# EAGLE design Reach_B0 (EAGLE 7.7.0)
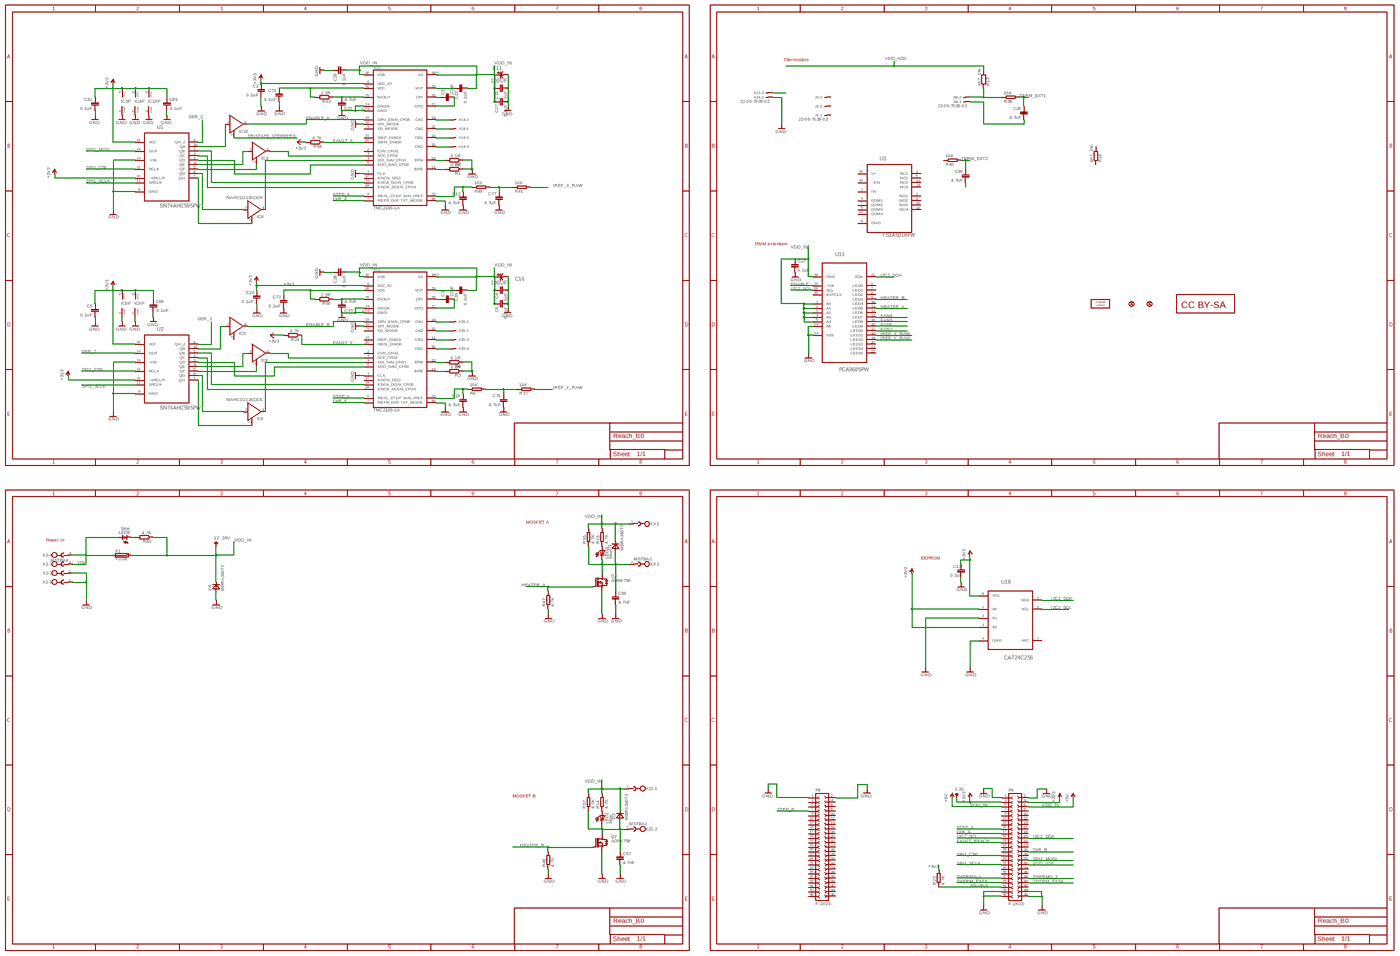
[diagram p0: schematic, sheet 1, overview]
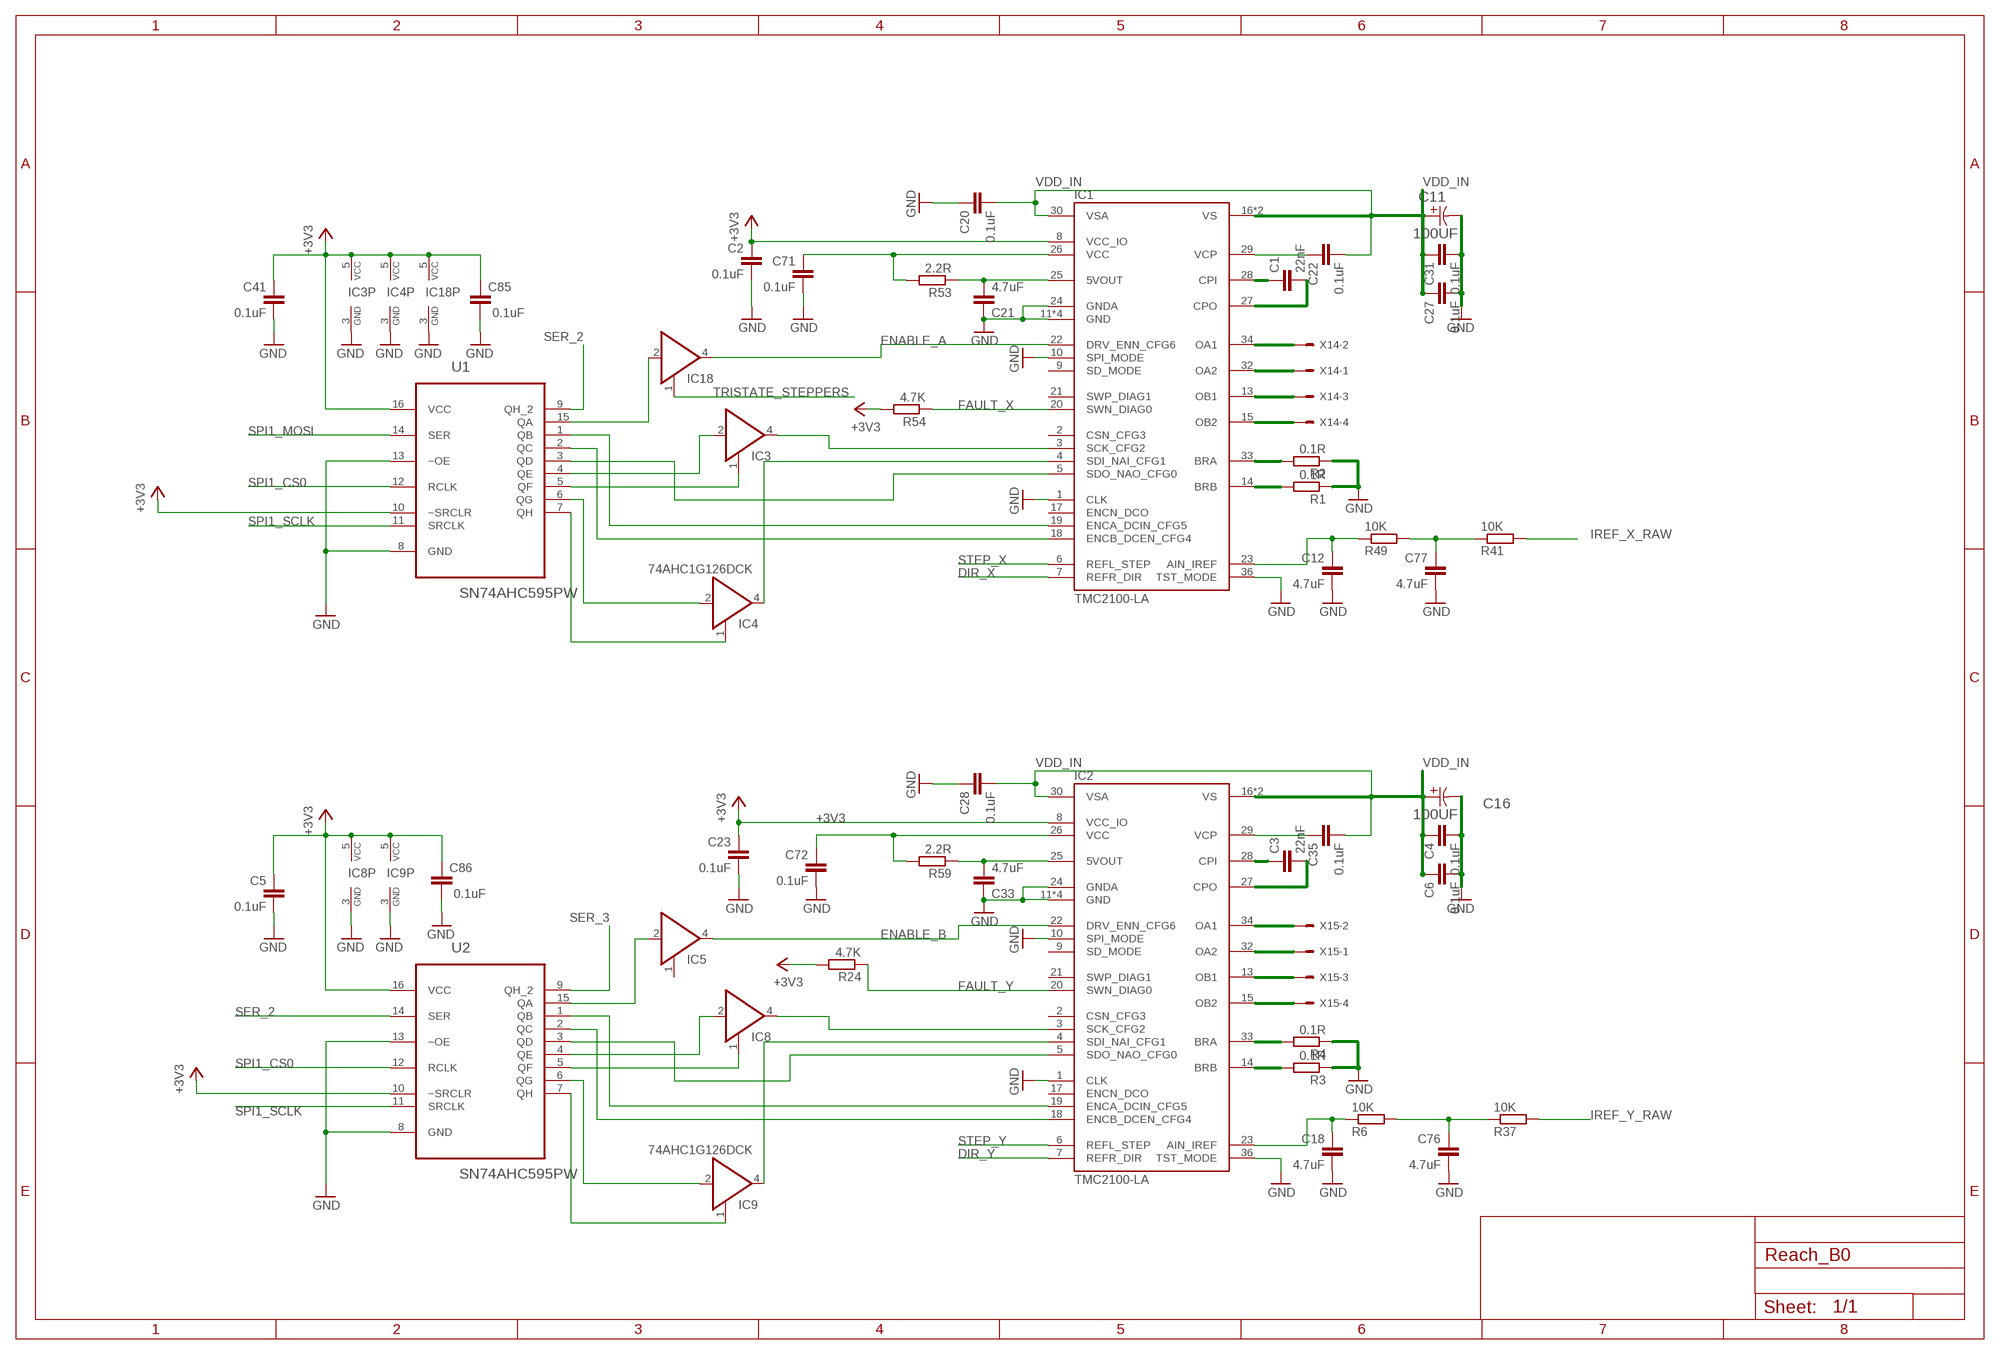
[diagram p1: schematic, sheet 1, part 1 of 4]
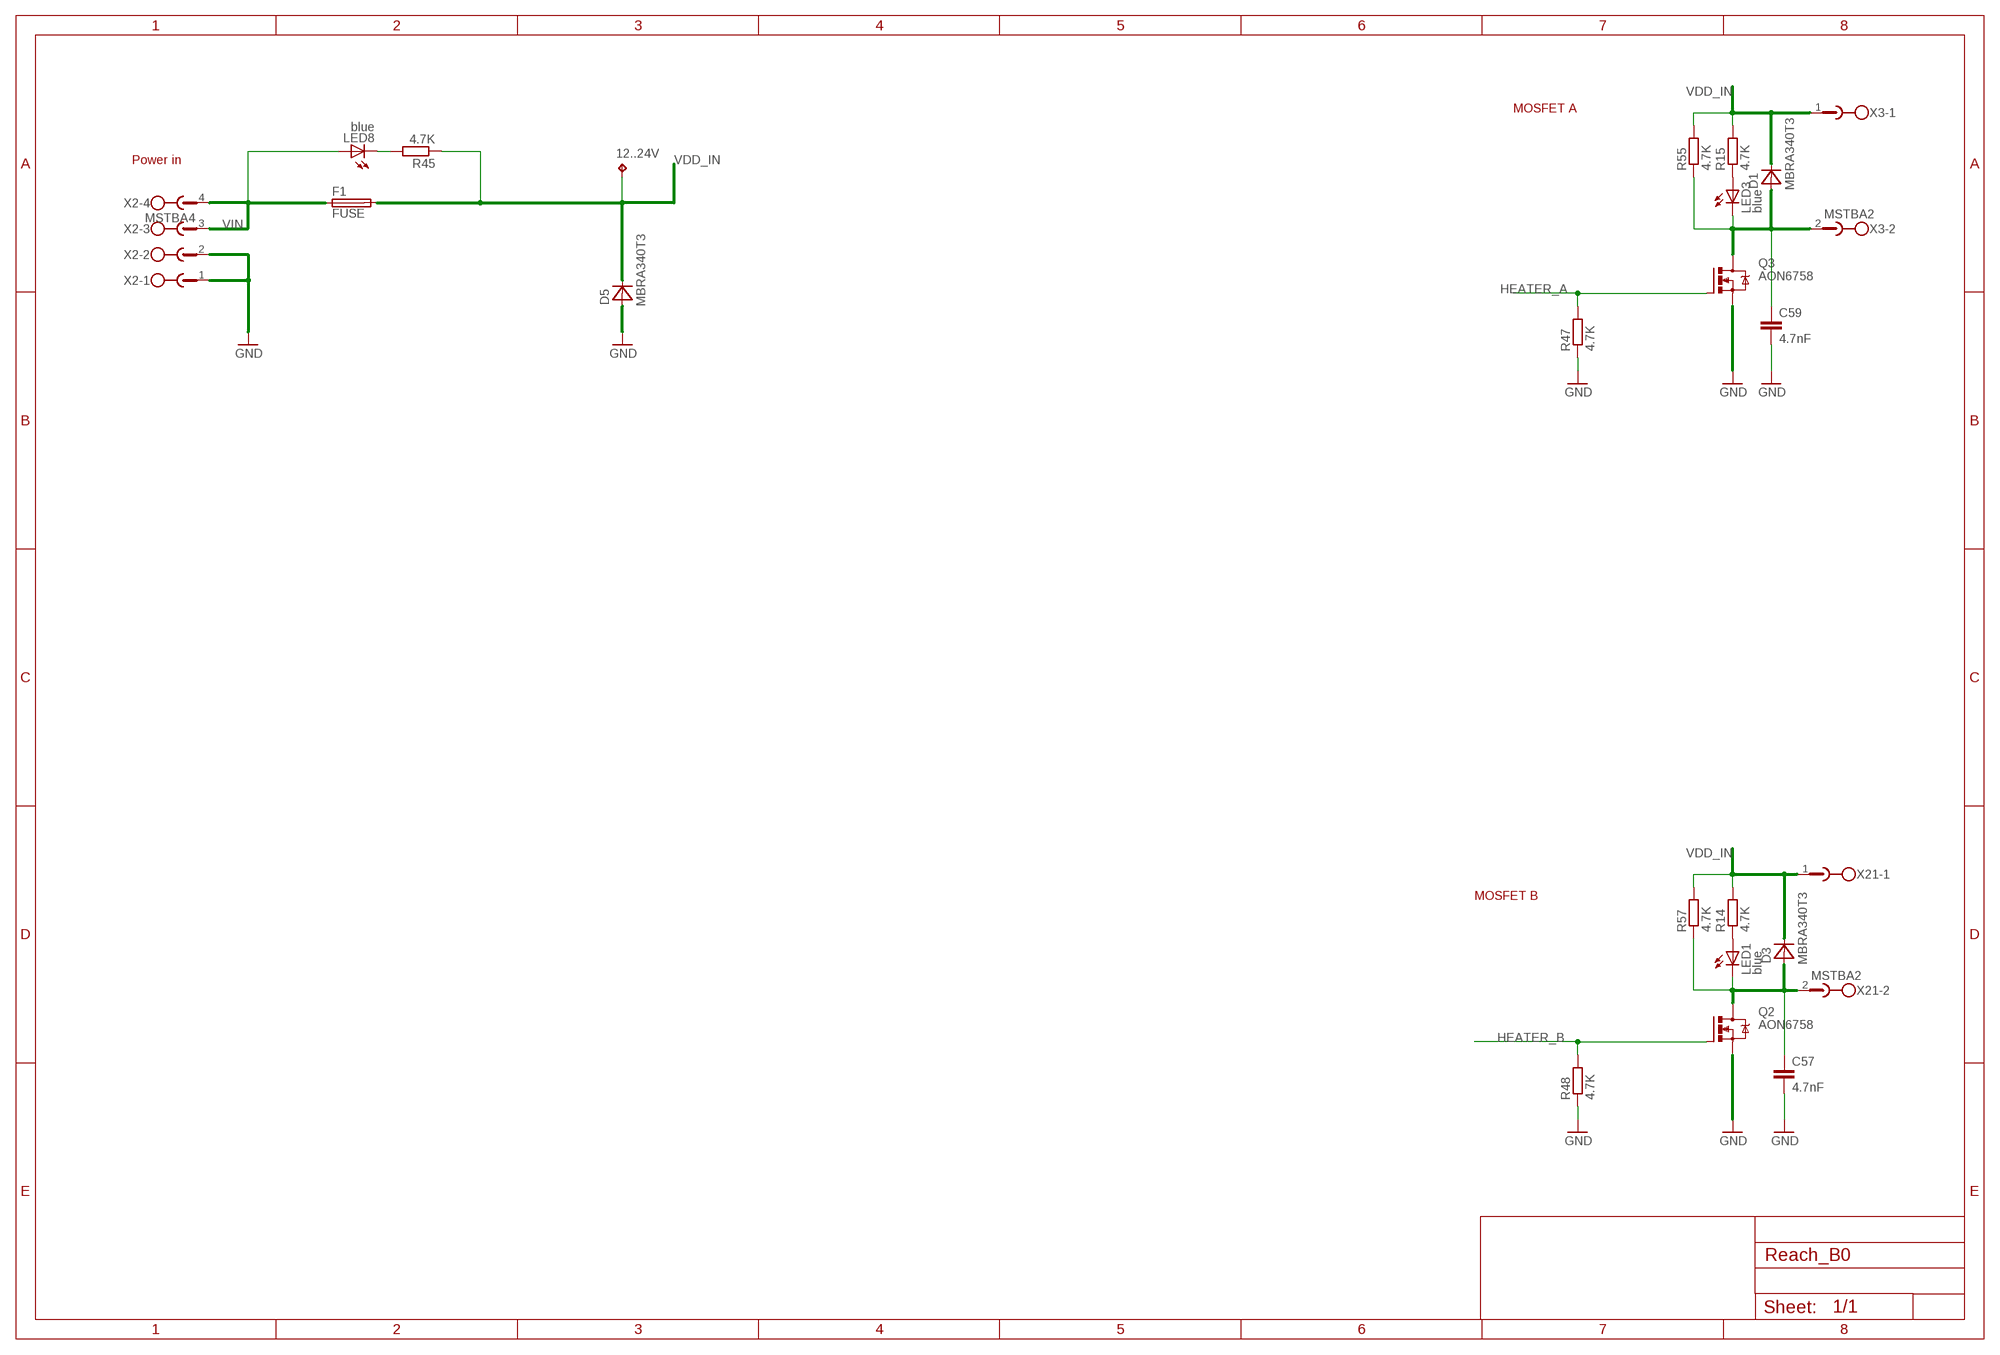
[diagram p2: schematic, sheet 1, part 2 of 4]
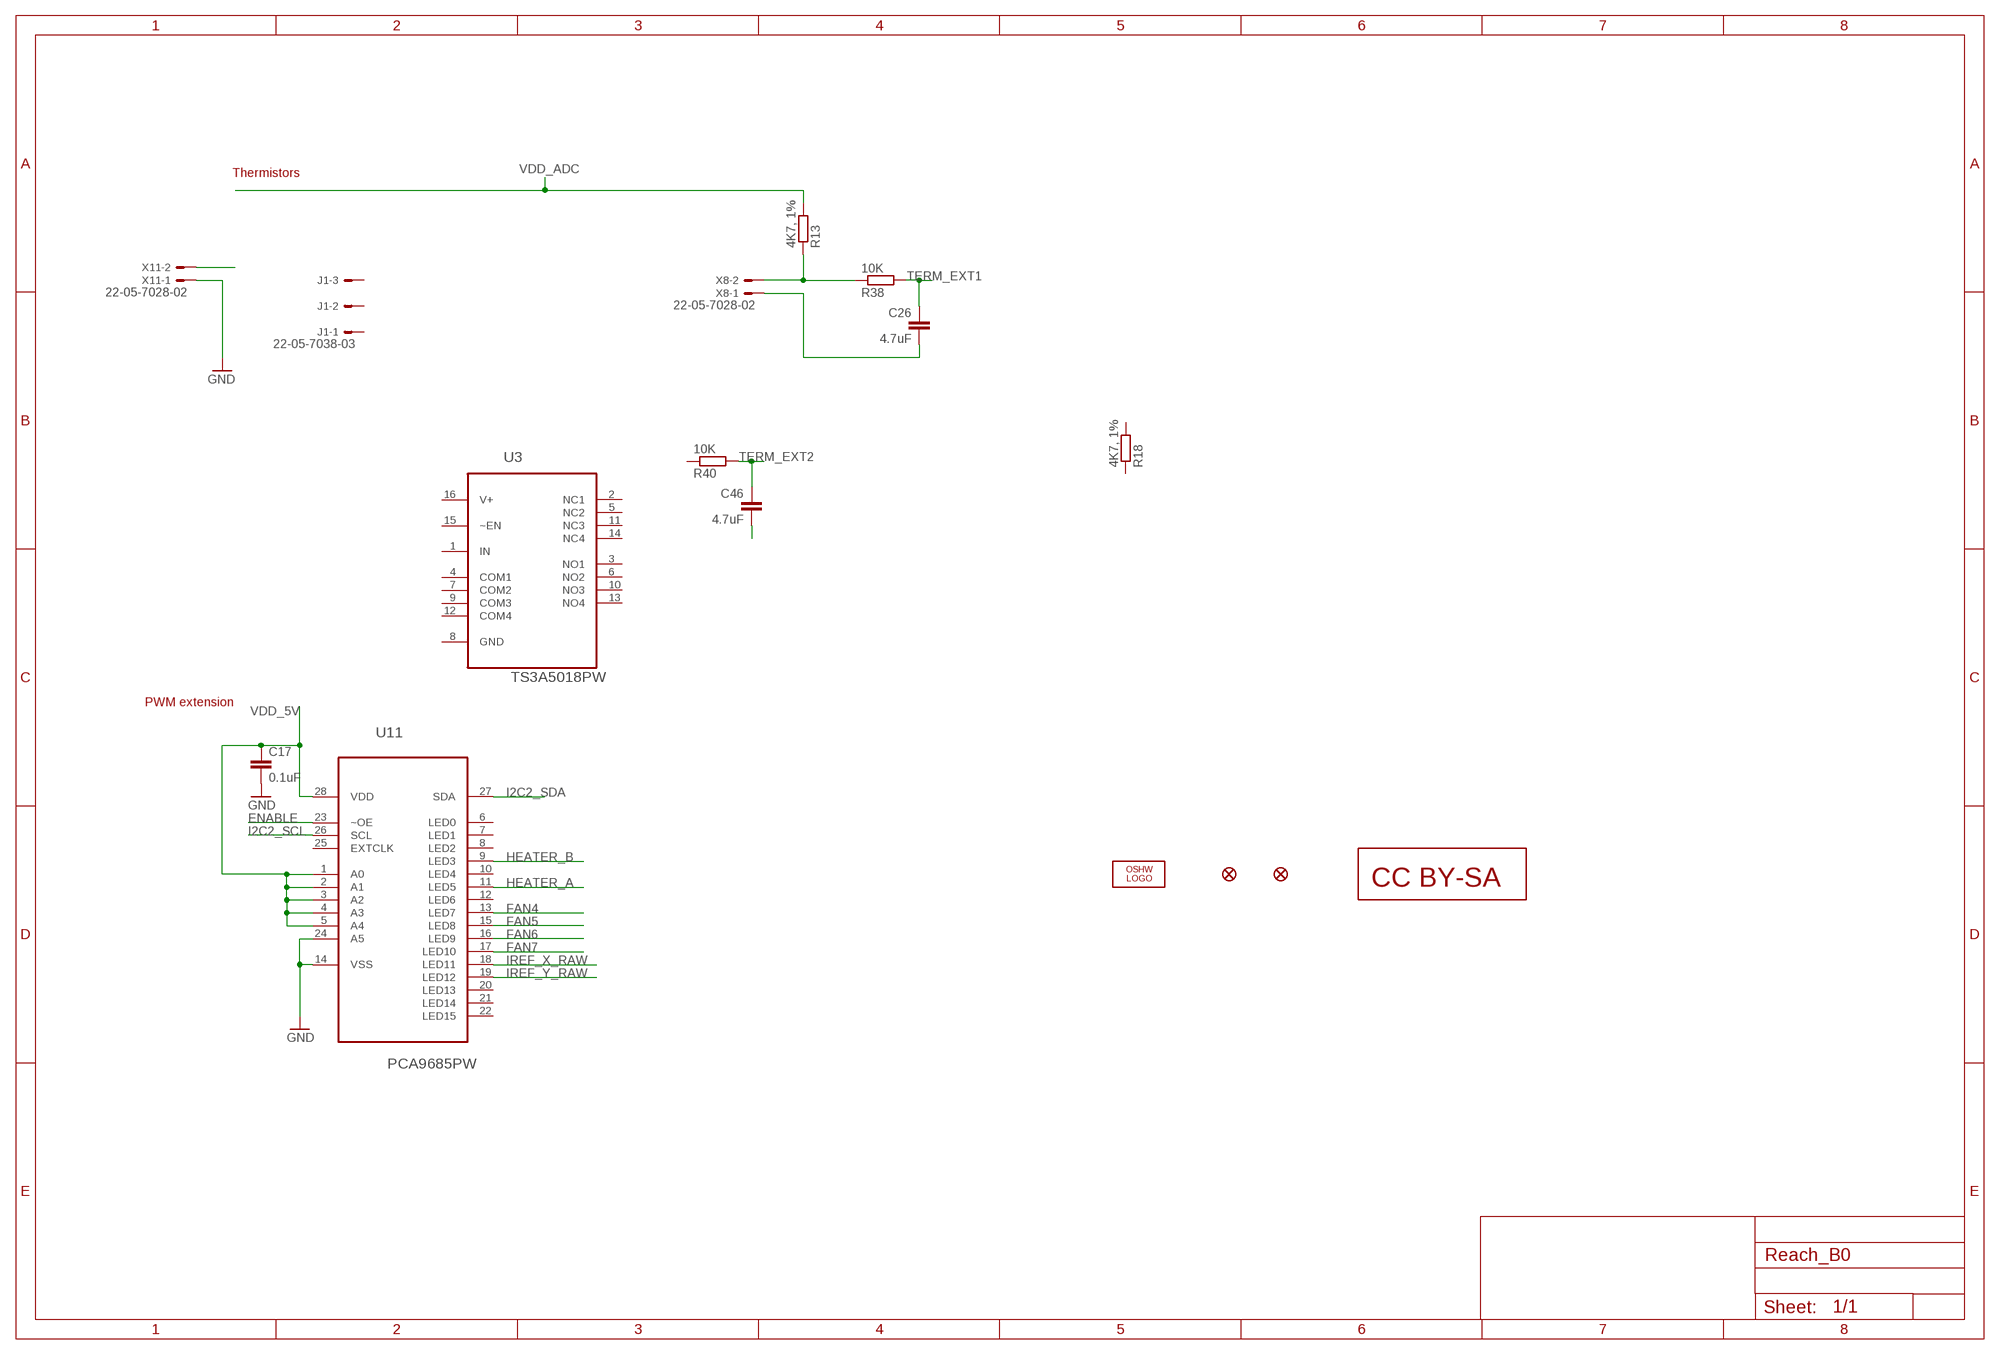
[diagram p3: schematic, sheet 1, part 3 of 4]
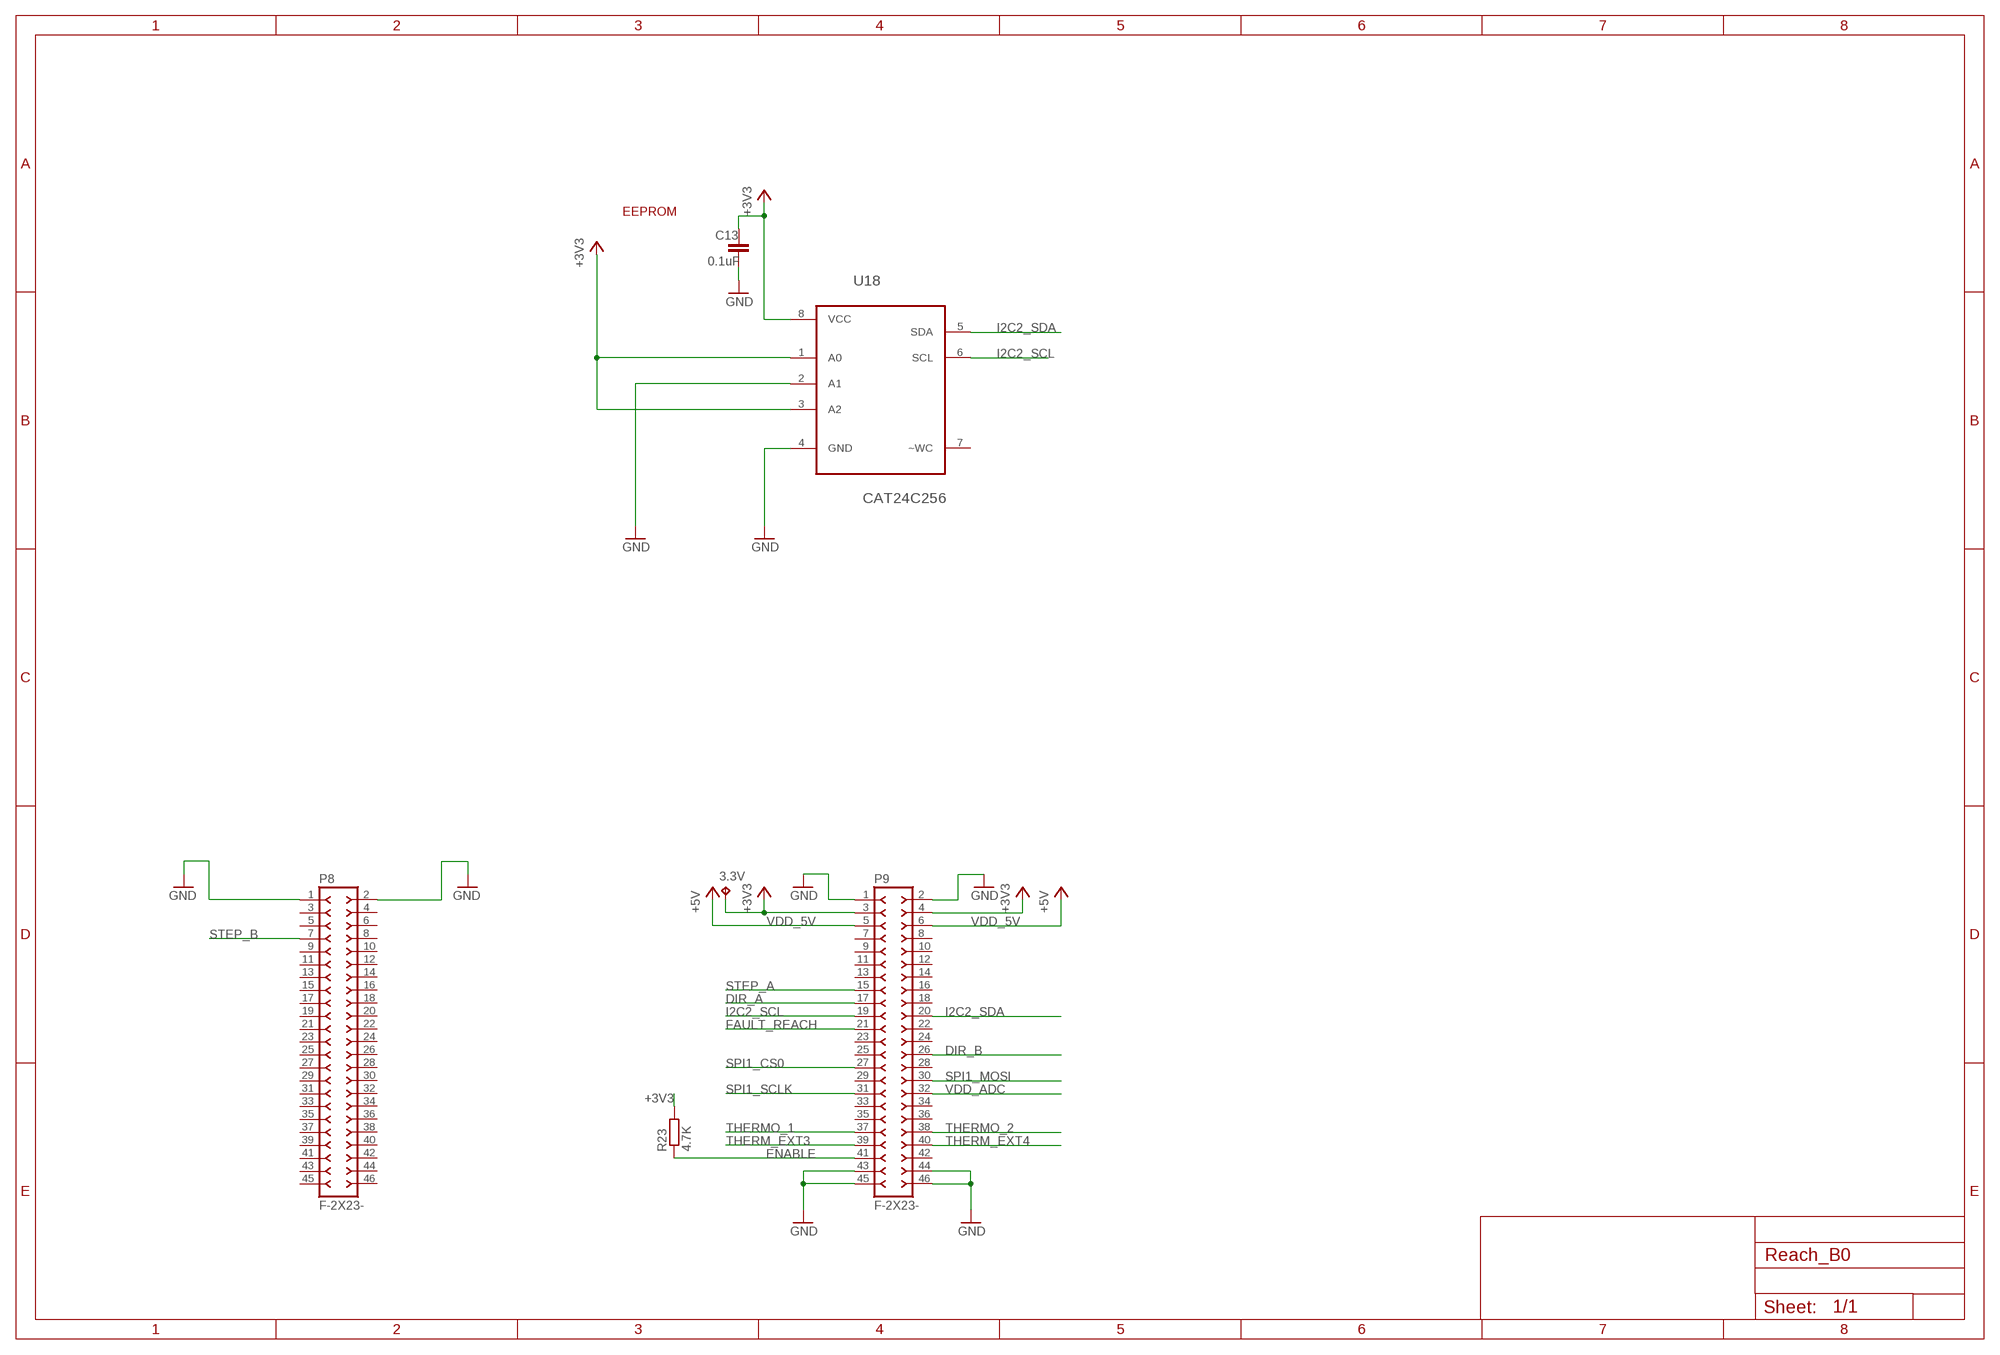
[diagram p4: schematic, sheet 1, part 4 of 4]

## Parts
3.3V  TPB1,27  [B1,27]
12..24V  TPB1,27  [B1,27]
C1  22nF  C-EUC0402  [C0402]
C2  0.1uF  C-EUC0402  [C0402]
C3  22nF  C-EUC0402  [C0402]
C4  0.1uF  C-EUC0402  [C0402]
C5  0.1uF  C-EUC0402  [C0402]
C6  0.1uF  C-EUC0402  [C0402]
C11  100UF  EEE-FK1V101XP-CASE-D8  [CAPAE660X800N]
C12  4.7uF  C-EUC0402  [C0402]
C13  0.1uF  C-EUC0402  [C0402]
C16  100UF  EEE-FK1V101XP-CASE-D8  [CAPAE660X800N]
C17  0.1uF  C-EUC0402  [C0402]
C18  4.7uF  C-EUC0402  [C0402]
C20  0.1uF  C-EUC0402  [C0402]
C21  4.7uF  C-EUC0402  [C0402]
C22  0.1uF  C-EUC0402  [C0402]
C23  0.1uF  C-EUC0402  [C0402]
C26  4.7uF  C-EUC0402  [C0402]
C27  0.1uF  C-EUC0402  [C0402]
C28  0.1uF  C-EUC0402  [C0402]
C31  0.1uF  C-EUC0402  [C0402]
C33  4.7uF  C-EUC0402  [C0402]
C35  0.1uF  C-EUC0402  [C0402]
C41  0.1uF  C-EUC0402  [C0402]
C46  4.7uF  C-EUC0402  [C0402]
C57  4.7nF  C-EUC0402  [C0402]
C59  4.7nF  C-EUC0402  [C0402]
C71  0.1uF  C-EUC0402  [C0402]
C72  0.1uF  C-EUC0402  [C0402]
C76  4.7uF  C-EUC0402  [C0402]
C77  4.7uF  C-EUC0402  [C0402]
C85  0.1uF  C-EUC0402  [C0402]
C86  0.1uF  C-EUC0402  [C0402]
D1  MBRA340T3  [SMA]
D3  MBRA340T3  [SMA]
D5  MBRA340T3  [SMA]
F1  FUSE  [3557]
IC1  TMC2100-LA  [QFN36-PAD]
IC2  TMC2100-LA  [QFN36-PAD]
IC3  74AHC1G126DCK  [SC70-5]
IC4  74AHC1G126DCK  [SC70-5]
IC5  74AHC1G126DCK  [SC70-5]
IC8  74AHC1G126DCK  [SC70-5]
IC9  74AHC1G126DCK  [SC70-5]
IC18  74AHC1G126DCK  [SC70-5]
J1  22-05-7038-03  [7395-03]
JP1  FIDUCIAL1X2.5  [FIDUCIAL-1X2.5]
JP2  FIDUCIAL1X2.5  [FIDUCIAL-1X2.5]
LED1  blue  LEDCHIP-LED0603  [CHIP-LED0603]
LED3  blue  LEDCHIP-LED0603  [CHIP-LED0603]
LED8  blue  LEDCHIP-LED0603  [CHIP-LED0603]
LOGO1  OSHW_LOGO_FILLX0200-NT  [OSHW_FILLX200_NOTEXT]
P8  F-2X23-  [DIL-100-2X23]
P9  F-2X23-  [DIL-100-2X23]
Q2  AON6758  [8-DFN-EP-(5X6)]
Q3  AON6758  [8-DFN-EP-(5X6)]
R1  0.1R  R-EU_R0805  [R0805]
R2  0.1R  R-EU_R0805  [R0805]
R3  0.1R  R-EU_R0805  [R0805]
R4  0.1R  R-EU_R0805  [R0805]
R6  10K  R-EU_R0402  [R0402]
R13  4K7, 1%  R-EU_R0402  [R0402]
R14  4.7K  R-EU_R0402  [R0402]
R15  4.7K  R-EU_R0402  [R0402]
R18  4K7, 1%  R-EU_R0402  [R0402]
R23  4.7K  R-EU_R0402  [R0402]
R24  4.7K  R-EU_R0402  [R0402]
R37  10K  R-EU_R0402  [R0402]
R38  10K  R-EU_R0402  [R0402]
R40  10K  R-EU_R0402  [R0402]
R41  10K  R-EU_R0402  [R0402]
R45  4.7K  R-EU_R0402  [R0402]
R47  4.7K  R-EU_R0402  [R0402]
R48  4.7K  R-EU_R0402  [R0402]
R49  10K  R-EU_R0402  [R0402]
R53  2.2R  R-EU_R0402  [R0402]
R54  4.7K  R-EU_R0402  [R0402]
R55  4.7K  R-EU_R0402  [R0402]
R57  4.7K  R-EU_R0402  [R0402]
R59  2.2R  R-EU_R0402  [R0402]
U1  SN74AHC595PW  [SOP65P640X120-16N]
U2  SN74AHC595PW  [SOP65P640X120-16N]
U3  TS3A5018PW  [SOP65P640X120-16N]
U11  PCA9685PW  [SOP65P640X110-28N]
U18  CAT24C256  [SOIC127P600X175-8N]
U$4  CC-BY-SA  [CC-BY-SA]
X2  MSTBA4  [MSTBA4]
X3  MSTBA2  [MSTBA2]
X8  22-05-7028-02  [7395-02]
X11  22-05-7028-02  [7395-02]
X14  22-05-7048-04  [7395-04]
X15  22-05-7048-04  [7395-04]
X21  MSTBA2  [MSTBA2]

## Nets
+3V3: 3.3V.TP C2.1 C5.1 C13.1 C23.1 C41.1 C85.1 C86.1 IC1.8(VCC_IO) IC2.8(VCC_IO) IC3.5(VCC) IC4.5(VCC) IC8.5(VCC) IC9.5(VCC) IC18.5(VCC) P9.3 P9.4 R23.2 R24.2 R54.2 U1.10(~SRCLR) U1.16(VCC) U2.10(~SRCLR) U2.16(VCC) U18.1(A0) U18.3(A2) U18.8(VCC)
DIR_A: P9.17
DIR_B: P9.26
DIR_X: IC1.7(REFR_DIR)
DIR_Y: IC2.7(REFR_DIR)
ENABLE: P9.41 R23.1 U11.23(~OE)
ENABLE_A: IC1.22(DRV_ENN_CFG6) IC18.4(O)
ENABLE_B: IC2.22(DRV_ENN_CFG6) IC5.4(O)
FAN4: U11.13(LED7)
FAN5: U11.15(LED8)
FAN6: U11.16(LED9)
FAN7: U11.17(LED10)
FAULT_REACH: P9.21
FAULT_X: IC1.20(SWN_DIAG0) R54.1
FAULT_Y: IC2.20(SWN_DIAG0) R24.1
GND: C2.2 C4.2 C5.2 C6.2 C11.2 C12.2 C13.2 C16.2 C17.2 C18.2 C20.1 C21.1 C23.2 C27.2 C28.1 C31.2 C33.1 C41.2 C57.2 C59.2 C71.2 C72.2 C76.2 C77.2 C85.2 C86.2 D5.A IC1.1(CLK) IC1.10(SPI_MODE) IC1.11(GND) IC1.12(GND) IC1.24(GNDA) IC1.35(GND) IC1.36(TST_MODE) IC1.TP(GND) IC2.1(CLK) IC2.10(SPI_MODE) IC2.11(GND) IC2.12(GND) IC2.24(GNDA) IC2.35(GND) IC2.36(TST_MODE) IC2.TP(GND) IC3.3(GND) IC4.3(GND) IC8.3(GND) IC9.3(GND) IC18.3(GND) P8.1 P8.2 P9.1 P9.2 P9.43 P9.44 P9.45 P9.46 Q2.1(S) Q2.2(S) Q2.3(S) Q3.1(S) Q3.2(S) Q3.3(S) R1.1 R2.1 R3.1 R4.1 R47.1 R48.1 U1.8(GND) U1.13(~OE) U2.8(GND) U2.13(~OE) U11.14(VSS) U11.24(A5) U18.2(A1) U18.4(GND) X2.1 X2.2 X11.1
HEATER_A: Q3.4(G) R47.2 U11.11(LED5)
HEATER_B: Q2.4(G) R48.2 U11.9(LED3)
I2C2_SCL: P9.19 U11.26(SCL) U18.6(SCL)
I2C2_SDA: P9.20 U11.27(SDA) U18.5(SDA)
IREF_X: C77.1 R41.1 R49.2
IREF_X_RAW: R41.2 U11.18(LED11)
IREF_Y: C76.1 R6.2 R37.1
IREF_Y_RAW: R37.2 U11.19(LED12)
N$1: IC5.2(I) U2.15(QA)
N$2: IC2.13(OB1) X15.3
N$3: C3.2 IC2.27(CPO)
N$4: IC4.1(OE) U1.7(QH)
N$5: IC4.2(I) U1.6(QG)
N$6: IC1.18(ENCB_DCEN_CFG4) U1.2(QC)
N$8: LED8.C R45.2
N$9: C46.2
N$11: C26.2 X8.1
N$16: C1.1 IC1.28(CPI)
N$17: C1.2 IC1.27(CPO)
N$18: IC1.14(BRB) R1.2
N$19: IC1.33(BRA) R2.2
N$20: C12.1 IC1.23(AIN_IREF) R49.1
N$22: IC2.32(OA2) X15.1
N$31: C21.2 IC1.25(5VOUT) R53.1
N$33: C22.1 IC1.29(VCP)
N$34: IC3.2(I) U1.4(QE)
N$35: IC2.14(BRB) R3.2
N$36: IC2.33(BRA) R4.2
N$38: C18.1 IC2.23(AIN_IREF) R6.1
N$40: IC3.1(OE) U1.5(QF)
N$41: C3.1 IC2.28(CPI)
N$42: IC2.3(SCK_CFG2) IC8.4(O)
N$43: IC1.19(ENCA_DCIN_CFG5) U1.1(QB)
N$44: IC1.5(SDO_NAO_CFG0) U1.3(QD)
N$45: IC2.15(OB2) X15.4
N$46: IC2.34(OA1) X15.2
N$47: C33.2 IC2.25(5VOUT) R59.1
N$48: C35.1 IC2.29(VCP)
N$49: IC2.4(SDI_NAI_CFG1) IC9.4(O)
N$53: IC2.5(SDO_NAO_CFG0) U2.3(QD)
N$56: IC2.18(ENCB_DCEN_CFG4) U2.2(QC)
N$64: C57.1 D3.A LED1.C Q2.5(D) Q2.6(D) Q2.7(D) Q2.8(D) Q2.TH(D) R57.1 X21.2
N$65: IC2.19(ENCA_DCIN_CFG5) U2.1(QB)
N$66: IC9.1(OE) U2.7(QH)
N$67: IC9.2(I) U2.6(QG)
N$68: IC8.1(OE) U2.5(QF)
N$69: IC8.2(I) U2.4(QE)
N$108: C71.1 IC1.26(VCC) R53.2
N$110: C72.1 IC2.26(VCC) R59.2
N$120: IC18.2(I) U1.15(QA)
N$127: LED3.A R15.1
N$129: LED1.A R14.1
N$234: C59.1 D1.A LED3.C Q3.5(D) Q3.6(D) Q3.7(D) Q3.8(D) Q3.TH(D) R55.1 X3.2
N$237: R13.1 R38.1 X8.2
N$240: X11.2
SER_2: U1.9(QH_2) U2.14(SER)
SER_3: U2.9(QH_2)
SPI1_CS0: P9.27 U1.12(RCLK) U2.12(RCLK)
SPI1_MOSI: P9.30 U1.14(SER)
SPI1_SCLK: P9.31 U1.11(SRCLK) U2.11(SRCLK)
STEP_A: P9.15
STEP_B: P8.7
STEP_X: IC1.6(REFL_STEP)
STEP_Y: IC2.6(REFL_STEP)
TERM_EXT1: C26.1 R38.2
TERM_EXT2: C46.1 R40.2
THERM_EXT3: P9.39
THERM_EXT4: P9.40
THERMO_1: P9.37
THERMO_2: P9.38
TRISTATE_STEPPERS: IC18.1(OE)
VDD_5V: C17.1 P9.5 P9.6 U11.1(A0) U11.2(A1) U11.3(A2) U11.4(A3) U11.5(A4) U11.28(VDD) ; supply symbol labelled +5V
VDD_ADC: P9.32 R13.2
VDD_IN: 12..24V.TP C4.1 C6.1 C11.1 C16.1 C20.2 C22.2 C27.1 C28.2 C31.1 C35.2 D1.C D3.C D5.C F1.P$3 F1.P$4 IC1.16(VS) IC1.30(VSA) IC1.31(VS) IC2.16(VS) IC2.30(VSA) IC2.31(VS) R14.2 R15.2 R45.1 R55.2 R57.2 X3.1 X21.1
VIN: F1.P$1 F1.P$2 LED8.A X2.3 X2.4
X_A1: IC1.34(OA1) X14.2
X_A2: IC1.32(OA2) X14.1
X_B1: IC1.13(OB1) X14.3
X_B2: IC1.15(OB2) X14.4
X_CFG1: IC1.4(SDI_NAI_CFG1) IC4.4(O)
X_CFG2: IC1.3(SCK_CFG2) IC3.4(O)
Unconnected: IC1.2(CSN_CFG3) IC1.9(SD_MODE) IC1.17(ENCN_DCO) IC1.21(SWP_DIAG1) IC2.2(CSN_CFG3) IC2.9(SD_MODE) IC2.17(ENCN_DCO) IC2.21(SWP_DIAG1) IC5.1(OE) J1.1 J1.2 J1.3 P8.3 P8.4 P8.5 P8.6 P8.8 P8.9 P8.10 P8.11 P8.12 P8.13 P8.14 P8.15 P8.16 P8.17 P8.18 P8.19 P8.20 P8.21 P8.22 P8.23 P8.24 P8.25 P8.26 P8.27 P8.28 P8.29 P8.30 P8.31 P8.32 P8.33 P8.34 P8.35 P8.36 P8.37 P8.38 P8.39 P8.40 P8.41 P8.42 P8.43 P8.44 P8.45 P8.46 P9.7 P9.8 P9.9 P9.10 P9.11 P9.12 P9.13 P9.14 P9.16 P9.18 P9.22 P9.23 P9.24 P9.25 P9.28 P9.29 P9.33 P9.34 P9.35 P9.36 P9.42 R18.1 R18.2 R40.1 U3.1(IN) U3.2(NC1) U3.3(NO1) U3.4(COM1) U3.5(NC2) U3.6(NO2) U3.7(COM2) U3.8(GND) U3.9(COM3) U3.10(NO3) U3.11(NC3) U3.12(COM4) U3.13(NO4) U3.14(NC4) U3.15(~EN) U11.6(LED0) U11.7(LED1) U11.8(LED2) U11.10(LED4) U11.12(LED6) U11.20(LED13) U11.21(LED14) U11.22(LED15) U11.25(EXTCLK) U18.7(~WC)

## Notes on the sheet
- Thermistors
- PWM extension
- MOSFET A
- Power in
- EEPROM
- MOSFET B

## Power pins joined to a net without a drawn wire
GND: IC5.3(GND)
V+: U3.16(V+)
VCC: IC5.5(VCC)

## Library data of the parts
3.3V 12..24V = testpad:TP: Test pad
C1-C6 C12 C13 C17 C18 C20-C23 C26-C28 C31 C33 C35 C41 C46 C57 C59 C71 C72 C76 C77 C85 C86 = rcl:C-EU: CAPACITOR, European symbol
C11 C16 = Panasonic-EEEFK_EEEFP:EEE-: Aluminum Electrolytic Capacitors,Surface Mount Type; MPN: EEE-FK1V101XP; OC_FARNELL: 1850114; OC_NEWARK: 23T0869; PACKAGE: CASE-D8; SUPPLIER: PANASONIC; TOLERANCE: ±20 %; VOLTAGERATING: 35V
D1 D3 D5 = diode:MBRA340T3: Surface Mount Schottky Power Rectifier Source: http://www.onsemi.com/pub_link/Collateral/MBRA340T3-D.PDF
F1 = fuse:FUSE: Fuse
IC1 IC2 = we-chip:TMC2100: Trinamic TMC2100 Stepper Motor Driver (5V...46V, 1.2A, peak 1.7A, 256 microsteps)
IC3-IC5 IC8 IC9 IC18 = 74xx-little-de:74*1G126: Single Bus Buffer Gate With 3-State Outputs
J1 = con-molex:22-?-03: CONNECTOR wire to board 2.54 mm (.1 inch) pitch header; OC_FARNELL: unknown; OC_NEWARK: unknown
JP1 JP2 = SparkFun:FIDUCIAL: Fiducial Alignment Points Various fiducial points for machine vision alignment.
LED1 LED3 LED8 = led:LED: LED OSRAM: - CHIPLED LG R971, LG N971, LY N971, LG Q971, LY Q971, LO R971, LY R971 LH N974, LH R974 LS Q976, LO Q976, LY Q976 LO Q996 - Hyper CHIPLED LW Q18S LB Q993, LB Q99A, LB R99A - SideLED LS A670, LO A670, LY A670, LG A670, LP A670 LB A673, LV A673, LT A673, LW A673 LH A674 LY A675 LS A676, LA A676, LO A676, LY A676, LW A676 LS A679, LY A679, LG A679 - Hyper Micro SIDELED® LS Y876, LA Y876, LO Y876, LY Y876 LT Y87S - SmartLED LW L88C, LW L88S LB L89C, LB L89S, LG L890 LS L89K, LO L89K, LY L89K LS L896, LA L896, LO L896, LY L896 - TOPLED LS T670, LO T670, LY T670, LG T670, LP T670 LSG T670, LSP T670, LSY T670, LOP T670, LYG T670 LG T671, LOG T671, LSG T671 LB T673, LV T673, LT T673, LW T673 LH T674 LS T676, LA T676, LO T676, LY T676, LB T676, LH T676, LSB T676, LW T676 LB T67C, LV T67C, LT T67C, LS T67K, LO T67K, LY T67K, LW E67C LS E67B, LA E67B, LO E67B, LY E67B, LB E67C, LV E67C, LT E67C LW T67C LS T679, LY T679, LG T679 LS T770, LO T770, LY T770, LG T770, LP T770 LB T773, LV T773, LT T773, LW T773 LH T774 LS E675, LA E675, LY E675, LS T675 LS T776, LA T776, LO T776, LY T776, LB T776 LHGB T686 LT T68C, LB T68C - Hyper Mini TOPLED® LB M676 - Mini TOPLED Santana® LG M470 LS M47K, LO M47K, LY M47K Source: http://www.osram.convergy.de LUXEON: - LUMILED® LXK2-PW12-R00, LXK2-PW12-S00, LXK2-PW14-U00, LXK2-PW14-V00 LXK2-PM12-R00, LXK2-PM12-S00, LXK2-PM14-U00 LXK2-PE12-Q00, LXK2-PE12-R00, LXK2-PE12-S00, LXK2-PE14-T00, LXK2-PE14-U00 LXK2-PB12-K00, LXK2-PB12-L00, LXK2-PB12-M00, LXK2-PB14-N00, LXK2-PB14-P00, LXK2-PB14-Q00 LXK2-PR12-L00, LXK2-PR12-M00, LXK2-PR14-Q00, LXK2-PR14-R00 LXK2-PD12-Q00, LXK2-PD12-R00, LXK2-PD12-S00 LXK2-PH12-R00, LXK2-PH12-S00 LXK2-PL12-P00, LXK2-PL12-Q00, LXK2-PL12-R00 Source: www.luxeon.com KINGBRIGHT: KA-3528ASYC Source: www.kingbright.com
LOGO1 = ohw-logo:OSHW_LOGO_FILL
P8 P9 = con-headers-jp:F-2X23-
Q2 Q3 = transistor-power:AON6758
R1-R4 R6 R13-R15 R18 R23 R24 R37 R38 R40 R41 R45 R47-R49 R53-R55 R57 R59 = rcl:R-EU_: RESISTOR, European symbol
U1 U2 = sn74hc595:SN74AHC595PW: 8 bit shift registers with 3-state output registers; MPN: SN74AHC595PW; OC_FARNELL: 1741463; OC_NEWARK: 50R5930; PACKAGE: TSSOP-16; SUPPLIER: Texas Instruments
U3 = Texas Instruments_By_element14_Batch_1:TS3A5018PW: 10-Ù QUAD SPDT ANALOG SWITCH; MPN: TS3A5018PW; OC_FARNELL: -; OC_NEWARK: 71J8329; PACKAGE: TSSOP-16; SUPPLIER: TEXAS INSTRUMENTS
U11 = custom:PCA9685PW: 16-channel, 12-bit PWM Fm+ I2C-bus LED controller; MPN: PCA9685PW; OC_FARNELL: 1854074; OC_NEWARK: 19T6398; PACKAGE: TSSOP-28; SUPPLIER: NXP
U18 = custom:CAT24C256
U$4 = Replicape_B3:CC-BY-SA
X2 = con-phoenix-508:MSTBA4: PHOENIX; MF: FARNELL; MPN: 1757268; OC_FARNELL: 3705195; OC_NEWARK: 71C4163
X3 X21 = con-phoenix-508:MSTBA2: PHOENIX; MF: FARNELL; MPN: 1757242; OC_FARNELL: 3705171; OC_NEWARK: 71C4161
X8 X11 = con-molex:22-?-02: CONNECTOR wire to board 2.54 mm (.1 inch) pitch header; OC_FARNELL: 9731601; OC_NEWARK: unknown
X14 X15 = con-molex:22-?-04: CONNECTOR wire to board 2.54 mm (.1 inch) pitch header; OC_FARNELL: unknown; OC_NEWARK: unknown

## Net classes
1 power: width 1.27 mm

## Board
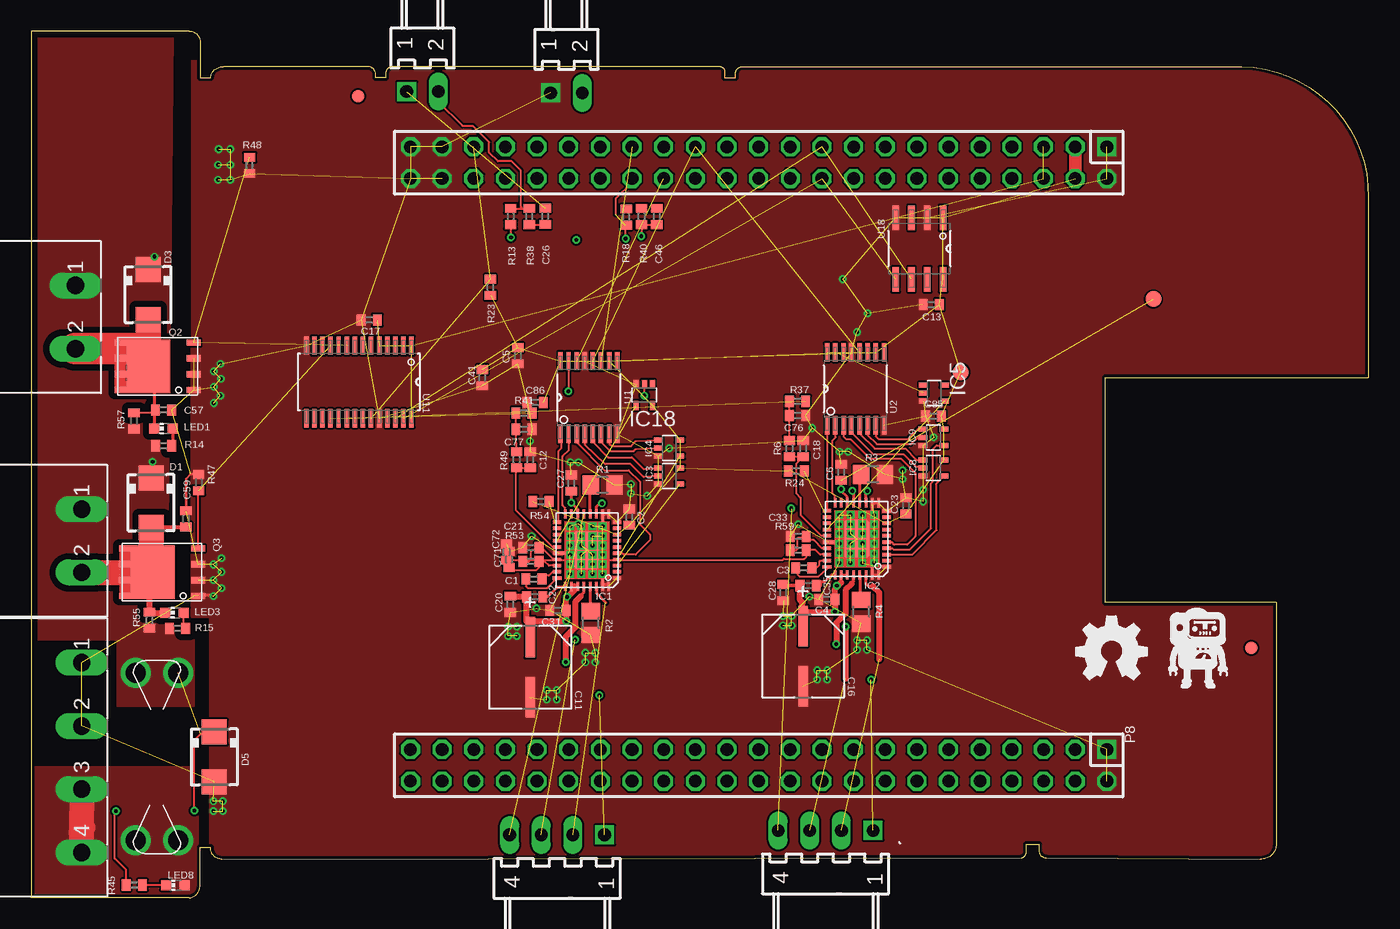
[diagram p5: board, top side]
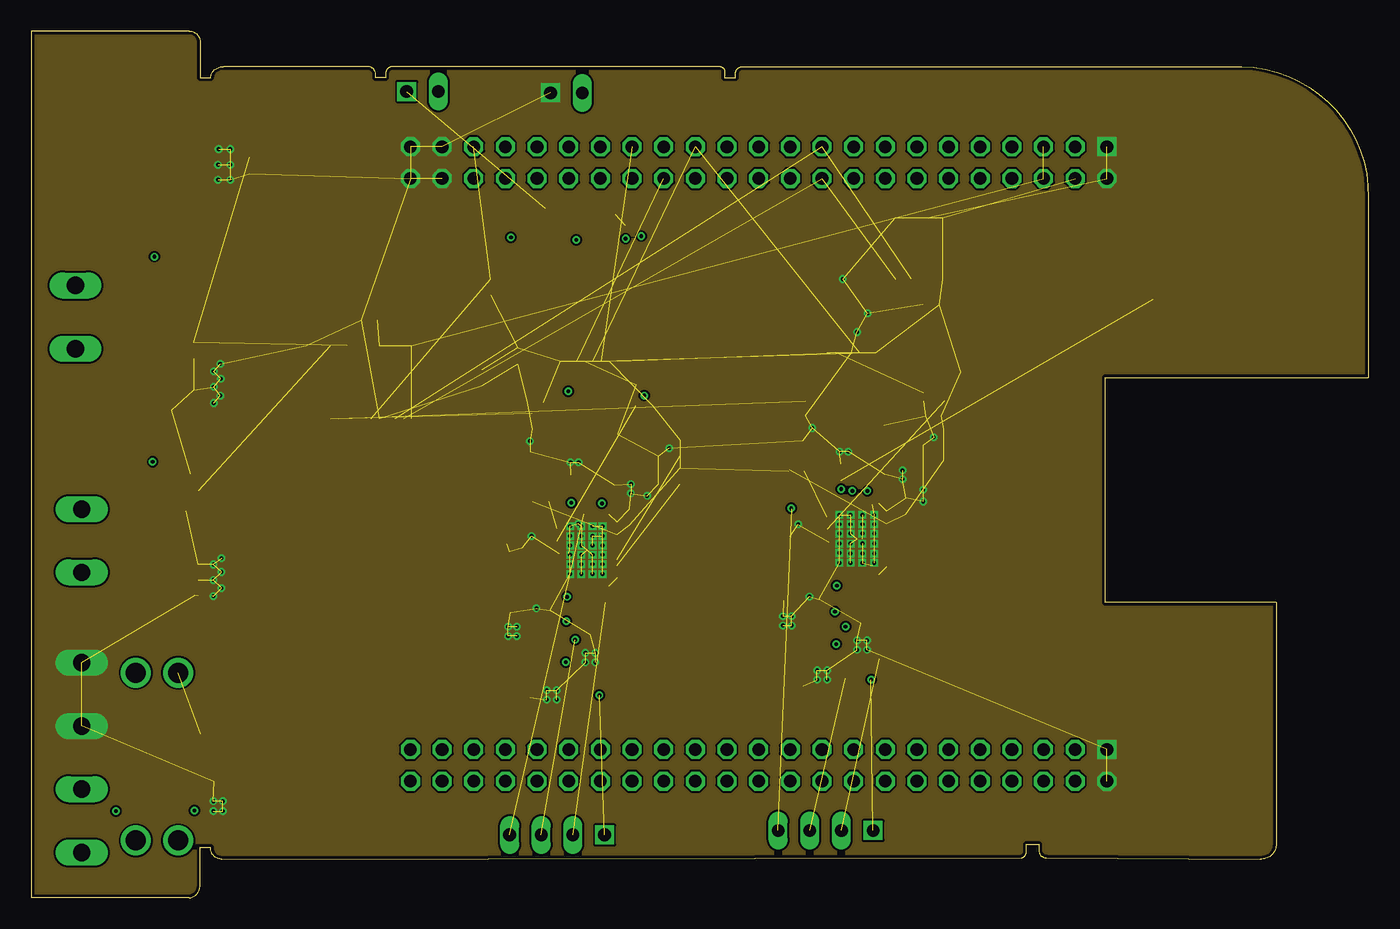
[diagram p6: board, inner layer GND]
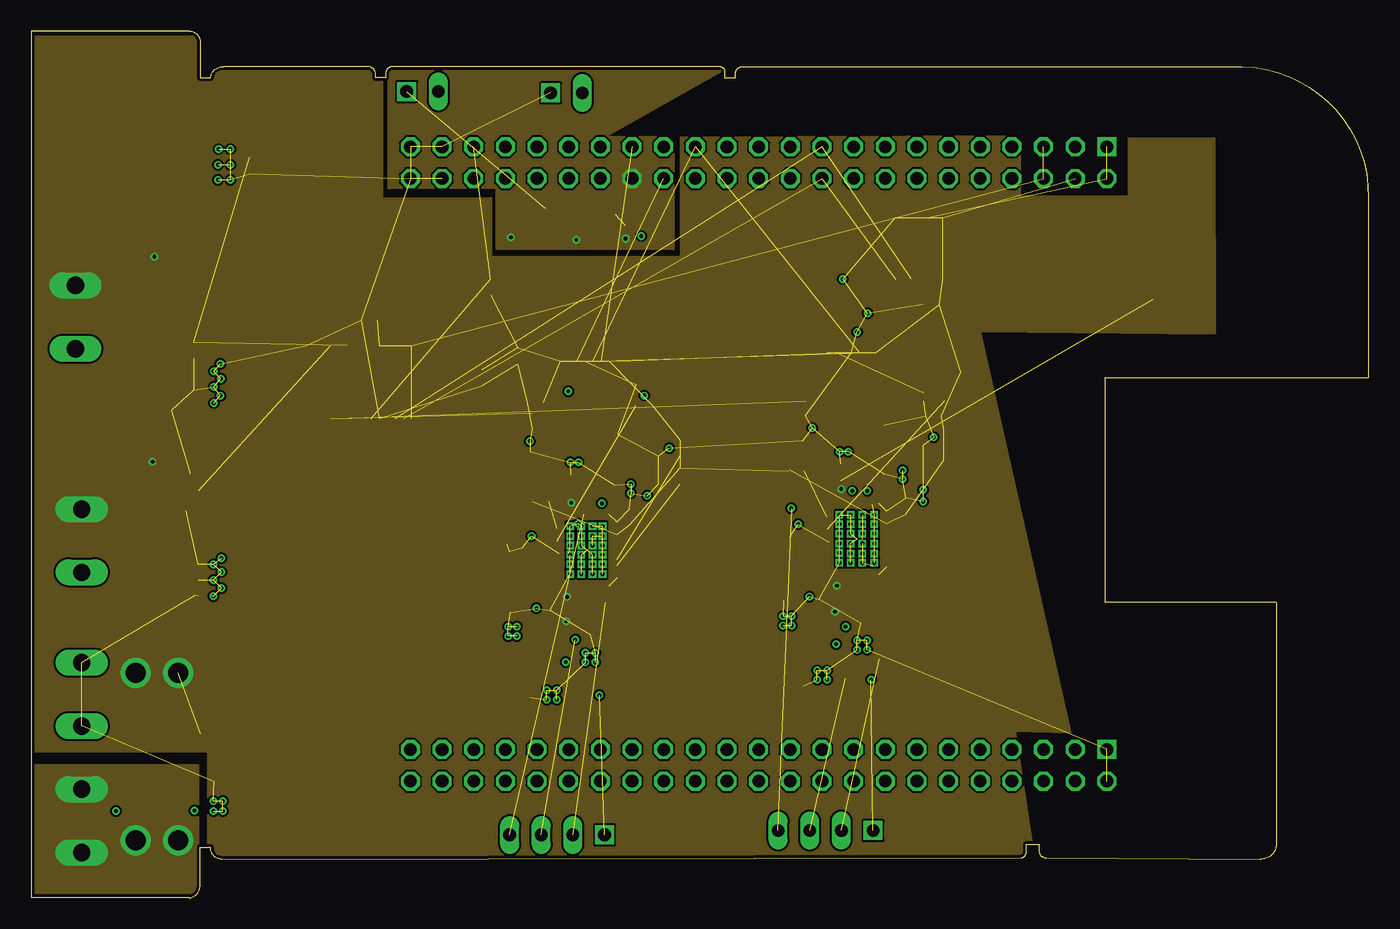
[diagram p7: board, inner layer VCC]
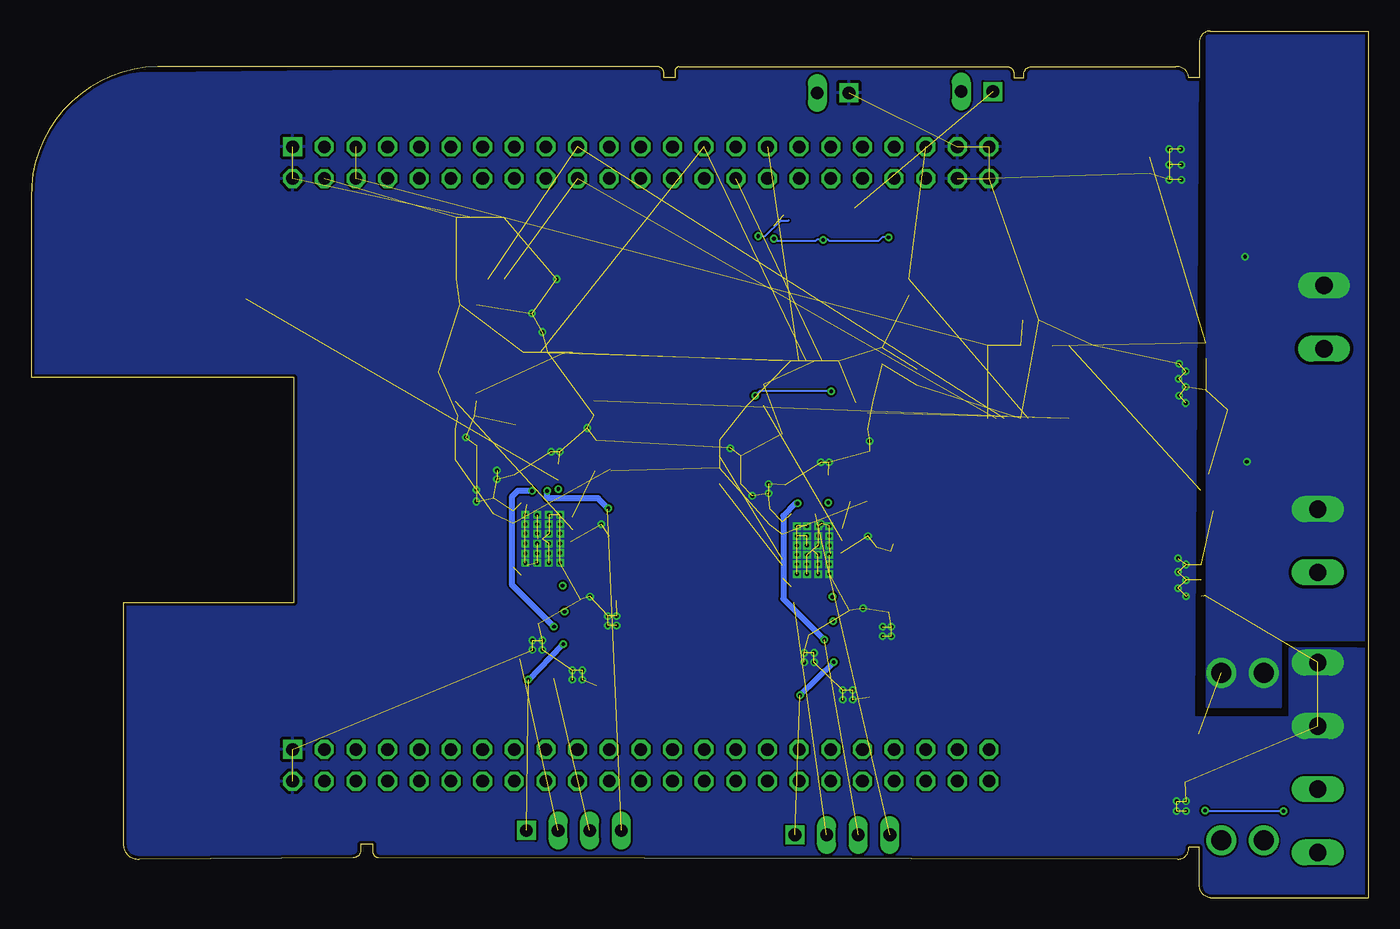
[diagram p8: board, bottom side, seen from below]

Size 107.3 x 69.55 mm. Coordinates in mm from the lower left corner, seen from the top.
Outline: 13.55,4.05 14.4,4.05 14.4,3.95 arc90 15.3,3.1 79.45,3.2 arc90 79.85,3.75 79.85,4.3 80.85,4.3 80.85,3.85 arc90 81.45,3.2 98.65,3.1 arc90 99.9,4.2 99.9,23.7 86.19,23.7 86.19,41.75 107.3,41.75 107.3,56.2 arc90 97.15,66.7 57.02,66.7 arc90 56.52,66.15 56.52,65.8 55.65,65.8 55.65,66.3 arc90 55.3,66.7 29,66.7 arc90 28.45,66.2 28.45,65.8 27.65,65.8 27.65,66.05 arc90 27.05,66.7 15.45,66.7 arc90 14.4,65.8 13.55,65.8 13.55,68.75 arc90 12.7,69.55 0,69.55 0,0 12.7,0 arc90 13.55,1.05 13.55,4.05
Copper layers (1*2*3*16): Top 0.035mm / dielectric 0.2mm / GND 0.035mm / dielectric 1.1mm / VCC 0.035mm / dielectric 0.2mm / Bottom 0.035mm
Design rules "default *": minimum track width 6mil, minimum drill 0.3mm, track to track 6mil, track to pad 6mil, pad to pad 6mil, via to via 6mil, smd to smd 0mil, copper to edge 10mil, drill to drill 10mil, minimum pad ring 10mil, minimum via ring 6mil, stop-mask expansion 2mil, vias tented up to drill 100mil, thermal gap 10mil

### Footprints (pad centres in the part's own frame; a part is rotated, then mirrored left to right if it is on the bottom)
B1,27 = smd 1.27 x 1.27: TP 0,0
C0402 = smd 0.7 x 0.9: 1 -0.65,0; 2 0.65,0
CAPAE660X800N = smd 3.251 x 0.762: 1 -2.413,0; 2 2.413,0
SMA = smd 2 x 2: A 2,0; C -2,0
3557 = drill 1.6: P$1 -6.73,1.7; P$2 -6.73,-1.7; P$3 6.73,-1.7; P$4 6.73,1.7
QFN36-PAD = smd 0.7 x 0.25: 1 -2.4,2.25; 2 -2.4,1.75; 3 -2.4,1.25; 4 -2.4,0.75; 5 -2.4,0.25; 6 -2.4,-0.25; 7 -2.4,-0.75; 8 -2.4,-1.25; 9 -2.4,-1.75; 10 -2.4,-2.25; 19 2.4,-2.25; 20 2.4,-1.75; 21 2.4,-1.25; 22 2.4,-0.75; 23 2.4,-0.25; 25 2.4,0.75; 26 2.4,1.25; 27 2.4,1.75; 28 2.4,2.25 | smd 0.25 x 0.7: 11 -1.75,-2.9; 13 -0.75,-2.9; 14 -0.25,-2.9; 15 0.25,-2.9; 16 0.75,-2.9; 17 1.25,-2.9; 18 1.75,-2.9; 29 1.75,2.9; 30 1.25,2.9; 31 0.75,2.9; 32 0.25,2.9; 33 -0.25,2.9; 34 -0.75,2.9; 36 -1.75,2.9 | smd 0.25 x 1: 12 -1.25,-2.75; 35 -1.25,2.75 | smd 1 x 0.25: 24 2.25,0.25 | smd 2 x 3: TP 0,0
SC70-5 = smd 0.4 x 0.7: 1 -0.65,-0.85; 2 0,-0.85; 3 0.65,-0.85; 4 0.65,0.85; 5 -0.65,0.85
7395-03 = drill 1.016 square: 1 2.54,0 | drill 1.016 long: 2 0,0; 3 -2.54,0
FIDUCIAL-1X2.5 = smd 1 x 1: 1 0,0
CHIP-LED0603 = smd 0.8 x 0.8: A 0,-0.75; C 0,0.75
DIL-100-2X23 = drill 1.016 square: 1 -27.94,-1.27 | drill 1.016 octagon: 2 -27.94,1.27; 3 -25.4,-1.27; 4 -25.4,1.27; 5 -22.86,-1.27; 6 -22.86,1.27; 7 -20.32,-1.27; 8 -20.32,1.27; 9 -17.78,-1.27; 10 -17.78,1.27; 11 -15.24,-1.27; 12 -15.24,1.27; 13 -12.7,-1.27; 14 -12.7,1.27; 15 -10.16,-1.27; 16 -10.16,1.27; 17 -7.62,-1.27; 18 -7.62,1.27; 19 -5.08,-1.27; 20 -5.08,1.27; 21 -2.54,-1.27; 22 -2.54,1.27; 23 0,-1.27; 24 0,1.27; 25 2.54,-1.27; 26 2.54,1.27; 27 5.08,-1.27; 28 5.08,1.27; 29 7.62,-1.27; 30 7.62,1.27; 31 10.16,-1.27; 32 10.16,1.27; 33 12.7,-1.27; 34 12.7,1.27; 35 15.24,-1.27; 36 15.24,1.27; 37 17.78,-1.27; 38 17.78,1.27; 39 20.32,-1.27; 40 20.32,1.27; 41 22.86,-1.27; 42 22.86,1.27; 43 25.4,-1.27; 44 25.4,1.27; 45 27.94,-1.27; 46 27.94,1.27
8-DFN-EP-(5X6) = smd 1.1 x 0.5: 1 -2.9,1.905; 2 -2.9,0.635; 3 -2.9,-0.635; 4 -2.9,-1.905; 5 2.9,-1.905; 6 2.9,-0.635; 7 2.9,0.635; 8 2.9,1.905 | smd 3.5 x 4.3: TH 0.75,0
R0805 = smd 1.3 x 1.5: 1 -0.95,0; 2 0.95,0
R0402 = smd 0.7 x 0.9: 1 -0.65,0; 2 0.65,0
SOP65P640X120-16N = smd 1.473 x 0.356: 1 -2.921,2.286; 2 -2.921,1.626; 3 -2.921,0.965; 4 -2.921,0.33; 5 -2.921,-0.33; 6 -2.921,-0.965; 7 -2.921,-1.626; 8 -2.921,-2.286; 9 2.921,-2.286; 10 2.921,-1.626; 11 2.921,-0.965; 12 2.921,-0.33; 13 2.921,0.33; 14 2.921,0.965; 15 2.921,1.626; 16 2.921,2.286
SOP65P640X110-28N = smd 1.473 x 0.356: 1 -2.921,4.216; 2 -2.921,3.581; 3 -2.921,2.921; 4 -2.921,2.286; 5 -2.921,1.626; 6 -2.921,0.965; 7 -2.921,0.33; 8 -2.921,-0.33; 9 -2.921,-0.965; 10 -2.921,-1.626; 11 -2.921,-2.286; 12 -2.921,-2.921; 13 -2.921,-3.581; 14 -2.921,-4.216; 15 2.921,-4.216; 16 2.921,-3.581; 17 2.921,-2.921; 18 2.921,-2.286; 19 2.921,-1.626; 20 2.921,-0.965; 21 2.921,-0.33; 22 2.921,0.33; 23 2.921,0.965; 24 2.921,1.626; 25 2.921,2.286; 26 2.921,2.921; 27 2.921,3.581; 28 2.921,4.216
SOIC127P600X175-8N = smd 1.981 x 0.533: 1 -2.464,1.905; 2 -2.464,0.635; 3 -2.464,-0.635; 4 -2.464,-1.905; 5 2.464,-1.905; 6 2.464,-0.635; 7 2.464,0.635; 8 2.464,1.905
MSTBA4 = drill 1.397 long: 1 -7.62,5.08; 2 -2.54,5.08; 3 2.54,5.08; 4 7.62,5.08
MSTBA2 = drill 1.397 long: 1 -2.54,5.08; 2 2.54,5.08
7395-02 = drill 1.016 square: 1 1.27,0 | drill 1.016 long: 2 -1.27,0
7395-04 = drill 1.016 square: 1 3.81,0 | drill 1.016 long: 2 1.27,0; 3 -1.27,0; 4 -3.81,0

### Placement (x,y rotation side)
3.3V  74.6,42.17 0 top
12..24V  90.05,48.05 90 top
C1  40.34,25.57 0 top
C2  48,30.55 90 top
C3  62,26.48 0 top
C4  63.85,23.95 180 top
C5  39.05,43.5 270 top
C6  65,34.15 90 top
C11  40.05,18.5 270 top
C12  40.05,35.15 90 top
C13  72.22,47.6 180 top
C16  61.95,19.4 270 top
C17  27.13,46.37 180 top
C18  61.95,36.05 90 top
C20  38.45,23.55 90 top
C21  40.1,28.1 0 top
C22  40.4,24.15 180 top
C23  70.2,31.45 90 top
C26  41.25,54.7 90 top
C27  43.34,33.28 90 top
C28  60.35,24.5 90 top
C31  42.28,23.06 180 top
C33  61.55,29 0 top
C35  62.35,25.05 180 top
C41  36.2,41.74 270 top
C46  50.2,54.67 90 top
C57  10.62,39.15 0 top
C59  12.43,30.4 90 top
C71  38.35,27.15 90 top
C72  38.15,27.75 90 top
C76  61.5,38.7 0 top
C77  39.55,37.6 0 top
C85  72.4,38.65 180 top
C86  40.45,39.75 180 top
D1  9.62,31.7 270 top
D3  9.38,48.4 270 top
D5  14.7,11.3 270 top
F1  10.1,11.33 90 top
IC1  44.6,27.9 180 top
IC2  66.25,28.8 180 top
IC3  51.2,33.85 270 top
IC4  51.2,36.1 270 top
IC5  72.45,40.5 270 top
IC8  72.4,34.5 270 top
IC9  72.4,36.95 270 top
IC18  49.2,40.35 180 top
J1  -17.1,-7.2 0 top  (outside the outline)
JP1  26.23,64.33 0 top
JP2  97.9,20.05 0 top
LED1  10.62,37.65 90 top
LED3  11.5,22.88 90 top
LED8  11.57,1 90 top
LOGO1  83.86,17.51 0 top
P8  58.38,10.62 180 top
P9  58.38,59 180 top
Q2  10.15,42.65 180 top
Q3  10.5,26.12 180 top
R1  45.85,33.12 180 top
R2  44.9,22.05 90 top
R3  67.55,33.98 180 top
R4  66.6,22.95 90 top
R6  60.85,36.05 90 top
R13  38.48,54.67 270 top
R14  10.62,36.27 180 top
R15  11.75,21.62 180 top
R18  47.75,54.62 270 top
R23  36.85,49 270 top
R24  61.4,34.25 180 top
R37  61.5,39.85 0 top
R38  39.98,54.67 270 top
R40  48.98,54.67 270 top
R41  39.55,38.9 0 top
R45  8.28,1.02 0 top
R47  13.45,33.33 270 top
R48  17.52,58.77 90 top
R49  38.95,35.15 90 top
R53  40.1,27 0 top
R54  40.9,31.8 180 top
R55  9.5,22.27 270 top
R57  8.25,38.27 270 top
R59  61.55,27.9 0 top
U1  44.75,40.15 90 top
U2  66.15,40.85 90 top
U3  -0.5,-14.95 0 top  (outside the outline)
U11  26.3,41.4 270 top
U18  71.28,52.1 270 top
U$1  [LOGO_BIG]  93.2,20.1 0 top
U$4  23.65,57.9 0 top
X2  -1.02,11.25 270 top
X3  -1.02,28.65 270 top
X8  31.4,64.7 180 top
X11  42.95,64.6 180 top
X14  42.2,5.05 0 top
X15  63.75,5.4 0 top
X21  -1.52,46.6 270 top

### Tracks (layer width: path | path; a pad name or v marks a point on that pad's centre or on a via)
+3V3  (25 unrouted)
  Top 0.152: 83.75,60.12 83.78,60.15 P9.3 | 60.85,34.35 R24.2
  Top 1: 83.75,60.12 83.78,60.1 P9.4
ENABLE  (2 unrouted)
ENABLE_A  (1 unrouted)
ENABLE_B  (1 unrouted)
FAULT_X  (1 unrouted)
FAULT_Y  (1 unrouted)
GND  (via drill 0.3)  (185 unrouted)
  Top 0.152: IC1.12 v45.85,29.82 | IC1.24 43.17,27.65 v43.25,27.52 | v45.05,28.27 44.98,28.27 IC1.TP
  Top 0.2: C59.2 12.43,33.62 12.8,34 13.43,34 R47.1
  Top 0.25: IC1.11 46,30.8 IC1.12 | IC1.36 46.2,25.15 IC1.35 v45.85,25.98 | IC2.36 67.5,25.9 IC2.35 67.5,26.68 v67.65,26.88 | IC2.24 64.08,28.48 v64.85,28.43 | IC2.11 67.65,31.7 IC2.12
  Top 0.254: 14.5,24.25 13.12,24.25
  Top 0.35: v66.7,28.43 66.65,28.8 IC2.TP
  other vias: 15.28,24.85 14.62,24.2 14.62,25.5 15.28,26.15 14.62,26.75 15.28,27.25 15.05,60.08 15.97,60.08 15,58.83 15.97,58.83 15,57.62 15.97,57.62 15.18,40.3 14.65,39.7 14.65,41 15.22,41.65 14.65,42.25 15.18,42.85 43.25,29.82 44.15,29.82 43.25,28.27 43.25,26.77 43.25,29.02 44.15,27.52 44.15,28.27 44.15,29.02 44.15,26.77 43.25,25.98 44.15,25.98 45.05,29.82 45.05,29.02 45.85,27.52 45.05,27.52 45.85,29.02 45.85,28.27 45.05,25.98 45.85,26.77 45.05,26.77 44.48,19.65 45.27,19.65 45.27,18.9 44.48,18.9 40.55,23.23 40.15,29.02 64.85,30.73 65.75,30.73 64.85,29.23 64.85,27.68 64.85,29.98 65.75,28.43 65.75,29.23 65.75,29.98 65.75,27.62 64.85,26.88 65.75,26.88 66.7,30.73 67.65,30.73 66.7,29.23 66.7,27.62 66.7,29.98 67.65,28.43 67.65,29.23 67.65,29.98 67.65,27.62 66.7,26.88 51.2,36.08 66.28,20.65 67.08,20.65 67.08,19.9 66.28,19.9 43.92,34.95 43.27,34.95 62.45,24.18 69.92,33.6 71.58,32.75 71.58,31.8 69.92,34.3 64.88,35.8 65.58,35.8 48.12,32.45 48.12,33.2 65.12,49.65 41.38,16.65 42.17,16.65 42.17,15.9 41.38,15.9 49.42,32.25 43.9,30.02 63.08,18.25 63.88,18.25 63.88,17.5 63.08,17.5 38.27,21.75 38.98,21.75 38.27,21 38.98,21 61.55,29.98 60.33,22.6 61.02,22.6 60.33,21.85 61.02,21.85 72.42,36.95 40.02,36.65 67.12,46.9 62.67,37.7 14.62,7.75 15.38,7.75 14.62,6.95 15.38,6.95 66.28,45.4
  pour Top (no thermals): 12.93,67.2 98.45,66.53 arc-90 107.2,57.35 107.3,41.9 86.75,41.75 86.75,23.62 99.9,23.57 99.9,1.2 arc-90 98.65,-0.05 14.38,0 14.38,22.5 12.88,22.5
  pour Bottom (isolate 0.152): 97.7,66.22 13.7,67.15 14,14.5 6,14.5 6,20 0,20 0,0 98.65,-0.05 arc90 99.9,1.2 99.9,23.57 86.75,23.62 86.75,41.75 107.25,41.75 107.4,56.85 arc90
  pour Bottom (no thermals): 0.95,20 0.95,11.95 6.3,12 6.3,20
  pour GND (no thermals): -0.4,69.75 107.25,69.85 107.35,0.1 -0.3,0
HEATER_A  (1 unrouted)
  Top 0.152: Q3.4 13.4,32.62 R47.2
  Top 0.2: 13.43,32.65 R47.2
HEATER_B  (2 unrouted)
  Top 0.152: 17.45,59.5 R48.2
I2C2_SCL  (2 unrouted)
I2C2_SDA  (2 unrouted)
IREF_X
  Top 0.152: R49.2 38.95,36.45 38.9,36.5 C77.1 R41.1
IREF_X_RAW  (1 unrouted)
IREF_Y
  Top 0.152: R6.2 C76.1 R37.1
IREF_Y_RAW  (1 unrouted)
N$1  (1 unrouted)
N$2  (via drill 0.3)  (1 unrouted)
  Top 0.25: IC2.13 67,32.55 v67.1,32.65
  Top 0.5: v65.35,21.75 65.35,17.6
  Bottom 0.5: v67.1,32.65 68.25,32.65 68.75,32.15 68.75,25.15 v65.35,21.75
N$3
  Top 0.152: C3.2 62.75,26.55 63.1,26.55 63.25,26.7 63.25,26.95 63.35,27.05 IC2.27
N$4
  Top 0.152: U1.7 46.38,36.47 46.6,36.25 48.15,36.25 48.5,36.65 IC4.1
N$5
  Top 0.152: U1.6 45.72,36.59 46.45,35.85 48.35,35.85 48.5,36 IC4.2
N$6
  Top 0.152: IC1.18 42.85,31.3 42.65,31.5 42.65,35.45 43.15,35.95 43.15,36.6 43.2,36.65 43.2,37.15 U1.2
N$8
  Top 0.152: R45.2 10.9,1.02 LED8.C
N$11  (1 unrouted)
N$16
  Top 0.152: C1.1 39.83,25.73 39.7,25.25 39.7,25 39.85,24.85 41.4,24.85 IC1.28
N$17
  Top 0.152: IC1.27 41.85,26.15 41.55,25.85 41.17,25.85 C1.2
N$18
  Top 0.25: IC1.14 44.85,33.12 R1.2
N$19
  Top 0.25: IC1.33 44.85,23.1 44.9,23.05 R2.2
N$20
  Top 0.152: IC1.23 41.85,28.15 38.9,31.1 38.9,34.45 R49.1 C12.1
N$22  (via drill 0.3)  (1 unrouted)
  Top 0.25: 65.85,25.2 65.85,25.25 66,25.4 IC2.32
  Top 0.5: 65.85,25.2 65.35,24.7 65.35,22.8 64.6,22.05 v64.6,20.35
  Bottom 0.5: v67.4,17.5 64.7,20.3 v64.6,20.35
N$31
  Top 0.152: IC1.25 41.9,27.15 40.95,28.1 C21.2 40.6,27.95 40.25,27.95 40.1,27.8 40.1,27.15 39.95,27 R53.1
N$33
  Top 0.25: IC1.29 42.85,24.9 42.2,24.9 41.45,24.15 C22.1
N$34
  Top 0.152: IC3.2 49.15,33.75 48.1,34.8 46.05,34.8 44.45,36.35 44.45,37.2 U1.4
N$35
  Top 0.25: IC2.14 66.5,33.88 R3.2
N$36
  Top 0.25: IC2.33 66.5,24 R4.2
N$38
  Top 0.152: IC2.23 63.4,29.05 61.75,30.7 61.75,32.1 61.4,32.45 61.4,34.85 C18.1 R6.1
N$40
  Top 0.152: U1.5 45.08,36.57 46.3,35.35 48.2,35.35 49.15,34.4 IC3.1
N$41
  Top 0.152: IC2.28 63.85,26.4 63.15,25.75 61.7,25.75 61.55,25.9 61.55,26.5 61.35,26.5 C3.1
N$42
  Top 0.152: IC2.3 70.7,27.55 72.65,29.5 72.65,33.25 IC8.4
N$43
  Top 0.152: U1.1 42.55,37.14 42.55,36.1 42.3,35.85 42.3,30.25 IC1.19
N$44
  Top 0.152: U1.3 43.78,36.52 46,34.3 47.95,34.3 48.85,33.4 48.85,29.95 49.65,29.15 49.65,28.7 48.5,27.55 47.55,27.55 47.45,27.65 IC1.5
N$45  (via drill 0.3)  (1 unrouted)
  Top 0.25: v65.9,32.65 66,32.6 IC2.15
  Top 0.5: 61.05,31.2 v61,31.25
  Bottom 0.5: v61,31.25 61.8,32.05 65.9,32.05 v65.9,32.65
N$46  (1 unrouted)
  Top 0.25: 67.55,25 67.2,25 67,25.2 IC2.34
  Top 0.5: 68.05,19.15 68.05,24.5 67.55,25
N$47
  Top 0.152: IC2.25 63.45,28.05 62.8,28.7 62.45,28.7 C33.2 62.05,28.9 61.55,28.9 61.5,28.85 61.5,28 61.4,27.9 R59.1
N$48
  Top 0.25: IC2.29 64.2,25.9 63.65,25.35 63.35,25.35 63.35,25.05 C35.1
N$49
  Top 0.152: IC2.4 69.1,28.05 69.2,27.95 70.5,27.95 72.2,29.65 72.2,33.25 72.35,33.4 72.35,36 72.65,36.3 IC9.4
N$53
  Top 0.152: U2.3 65.19,37.02 65.4,36.8 65.75,36.8 67.3,35.25 69.8,35.25 70.95,34.1 70.95,29 70.3,28.35 69.25,28.35 69.1,28.5 68.7,28.5 IC2.5
N$56
  Top 0.152: IC2.18 64.5,32.25 64.3,32.45 64.3,36.7 64.55,36.95 64.55,37.9 U2.2
N$64
  Top 0.152: R57.1 8.25,38.9 9.75,38.9 C57.1
  Top 0.254: 9.88,39.15 LED1.C | 9.88,39.15 C57.1 | 9.88,39.15 9.88,40.88 8.12,40.88 Q2.8 8,40.65 7.12,40.9 | Q2.6 8,43.4 8,44.06 8,44.52 Q2.5 | Q2.TH 9.75,43.4 9.38,44.15 | 7.12,42.08 Q2.7 7.6,41.15 7.6,41.02 7.12,42.98
  Top 0.5: 7.12,42.98 7.12,41.3 7.4,41.3 7.4,43.28 Q2.6
  Top 0.813: 7.12,40.9 7.12,42.98
  Top 2: D3.A 9.38,44.15 8.95,44.23 9.12,44.06
  Top 2.54: X21.2 8,44.06 9.12,44.06
N$65
  Top 0.152: U2.1 63.86,31.06 IC2.19
N$66
  Top 0.152: U2.7 67.78,37.02 68,36.8 70.35,36.8 71.15,37.6 IC9.1
N$67
  Top 0.152: U2.6 67.11,37.13 67.85,36.4 70.6,36.4 71.15,36.95 IC9.2
N$68
  Top 0.152: U2.5 66.48,37.27 67.7,36.05 70.15,36.05 71.05,35.15 IC8.1
N$69
  Top 0.152: U2.4 65.82,37.33 67.55,35.6 70,35.6 71,34.6 71.45,34.6 IC8.2
N$108
  Top 0.152: IC1.26 41.55,26.65 41.2,27 R53.2 40.75,26.5 40.55,26.3 38.35,26.3 38.4,26.5 C71.1
N$110
  Top 0.152: IC2.26 63.3,27.55 62.95,27.9 R59.2 62.2,27.35 62.05,27.2 60.4,27.2 60.3,27.1 C72.1
N$120  (via drill 0.3)
  Top 0.152: U1.15 43.12,40.67 v43.1,40.65 | v49.2,40.3 IC18.2
  Bottom 0.152: v43.1,40.65 48.85,40.65 v49.2,40.3
N$127
  Top 0.152: LED3.A 12.25,21.75 12.38,21.62 R15.1
N$129
  Top 0.254: LED1.A 11.38,36.4 R14.1
N$234
  Top 0.35: D1.A C59.1
  Top 0.5: Q3.8 7.3,24.22 7.3,28.03 Q3.5 Q3.6 9.12,26.75 | Q3.8 7.6,24.3 7.8,24.3 7.8,28 7.7,28 7.7,26.76 Q3.6 | Q3.7 Q3.8 | Q3.TH 9.5,26.12 R55.1 9.5,22.88 LED3.C
  Top 2: D1.A 9.6,27.1 9.55,27.05 9.55,26.75 9.12,26.75 9.39,26.49 | 9.39,26.49 Q3.TH | X3.2 9.01,26.11 9.39,26.49
N$237
  Top 0.152: R13.1 39.4,55.33 | 39.4,55.33 R38.1 | 39.4,55.33 39.3,55.42 39.3,58.35 38.55,59.1 37.45,59.1 36.75,59.8 36.75,60.62 35.42,61.95 34.6,61.95 32.67,63.88 X8.2
SER_2  (1 unrouted)
SPI1_CS0  (2 unrouted)
SPI1_MOSI  (1 unrouted)
SPI1_SCLK  (2 unrouted)
TERM_EXT1
  Top 0.152: R38.2 41.23,54.02 C26.1
TERM_EXT2  (via drill 0.3)
  Top 0.152: C46.1 R40.2 48.98,53.12 v48.95,53.1
  Bottom 0.152: v48.95,53.1 48.4,53.1 47.15,54.35 46.52,54.35
VDD_5V  (8 unrouted)
VDD_ADC  (via drill 0.3)  (1 unrouted)
  Top 0.152: R13.2 38.48,53.02 v38.5,53 | v47.7,52.9 47.7,53.92 | 46.9,54.83 46.9,56.1 48.2,57.4 48.2,57.72 P9.32
  Bottom 0.152: v38.5,53 39,53 39.3,52.7 43.25,52.7 43.35,52.8 v43.75,52.8 44.25,52.8 44.35,52.7 47.45,52.7 47.65,52.9 v47.7,52.9
  pour VCC (no thermals): 28.7,66.65 55.95,66.65 46.1,61.1 51.55,61.1 51.55,52 37.35,52.05 37.35,56.95 28.7,56.9
VDD_IN  (via drill 0.3)  (2 unrouted)
  Top 0.152: C28.2 60.7,25.05 | D5.C 14.55,13.15 13.6,13.15 13.1,12.65 v13.1,7 | R45.1 7.62,2.23 6.7,3.15 6.7,6.85 v6.8,6.95
  Top 0.25: IC1.30 43.6,25 IC1.31 | IC1.16 43.85,31.2 v43.35,31.7 43.35,32.47 C27.1 | IC2.16 65.5,32.15 65,32.65 v65,32.8 C6.1 | 65,25.3 IC2.30 IC2.31 | v64.65,25.05 64.7,25
  Top 0.3: C35.2 60.7,25.05 60.35,25.05 | 42.92,24.02 42.92,24.07 v43,24.15
  Top 0.5: 40.05,22.2 v42.95,22.2 42.95,23.35 | C31.1 42.92,24.02 43.6,24.7 43.6,25 | C20.2 38.4,24.15 C22.2 39.75,22.2 40.05,22.2 | C11.1 40.05,22.2 | 65,25.3 64.7,25 64.5,24.8 C4.1 64.5,22.9 61.9,22.9 | 61.9,22.9 61.9,23.7 61.7,23.9 C35.2 | 61.9,22.9 61.9,21.86 C16.1
  Bottom 0.152: v6.8,6.95 13.05,6.95 v13.1,7
  other vias: 64.5,22.95 9.9,51.45 9.75,35
  pour Top (isolate 0.5, no thermals): 13.03,15.35 6.95,15.35 6.95,20.7 0,20.7 0,69.5 11.38,69.5 10.88,21.75 13.03,21.75
  pour Bottom (isolate 0.254, no thermals): 13,69.5 13,15.32 7,15.32 7,20.7 0,20.7 0,69.5
  pour VCC (no thermals): 0.1,69.15 28.15,69.2 28.15,56.15 36.9,56.2 36.9,51.45 52.15,51.45 52.15,61.05 79.35,61.15 79.35,56.3 88.1,56.3 88.1,61 94.95,60.95 95,45.25 76.15,45.45 83.4,13.25 78.95,13.35 80.5,2.95 14.2,2.85 14.2,11.65 0.3,11.7
VIN
  Top 1.27: 4.5,5.62 4,5.25
  Top 2: X2.3 4,5.25 X2.4
  pour Top (no thermals): 0,10.5 13.38,10.5 13.38,0 0,0
  pour VCC (no thermals): 0.3,10.6 13.35,10.6 13.35,0.45 0.3,0.45
X_A1  (1 unrouted)
  Top 0.25: IC1.34 45.35,24.45 46.1,23.7
X_A2  (via drill 0.3)  (1 unrouted)
  Top 0.25: 44.1,24.2 44.1,24.25 44.35,24.5 IC1.32
  Top 0.5: 44.1,24.2 43.7,23.8 43.7,21.75 42.9,20.95 v42.9,18.9
  Bottom 0.5: v45.6,16.25 v42.9,18.9
X_B1  (via drill 0.3)  (1 unrouted)
  Top 0.25: IC1.13 45.35,31.4 45.6,31.65 v45.8,31.65
  Bottom 0.5: v45.8,31.65 45.95,31.65 46.95,30.65 46.95,24 v43.65,20.7
X_B2  (1 unrouted)
X_CFG1  (1 unrouted)
X_CFG2  (1 unrouted)

### Text on the board
Document: A | B | H | Thermistors | End stops | HBP | reach | Rev B0 | Power | Heaters | E | ++12..24V -- | 20 A | Steppers | A | B | Fuse blown
tDocu: Fuse | 20A